# Altium schematic sheet USER_IO.SchDoc
size Tabloid; SheetNumber: 1; SheetTotal: 7
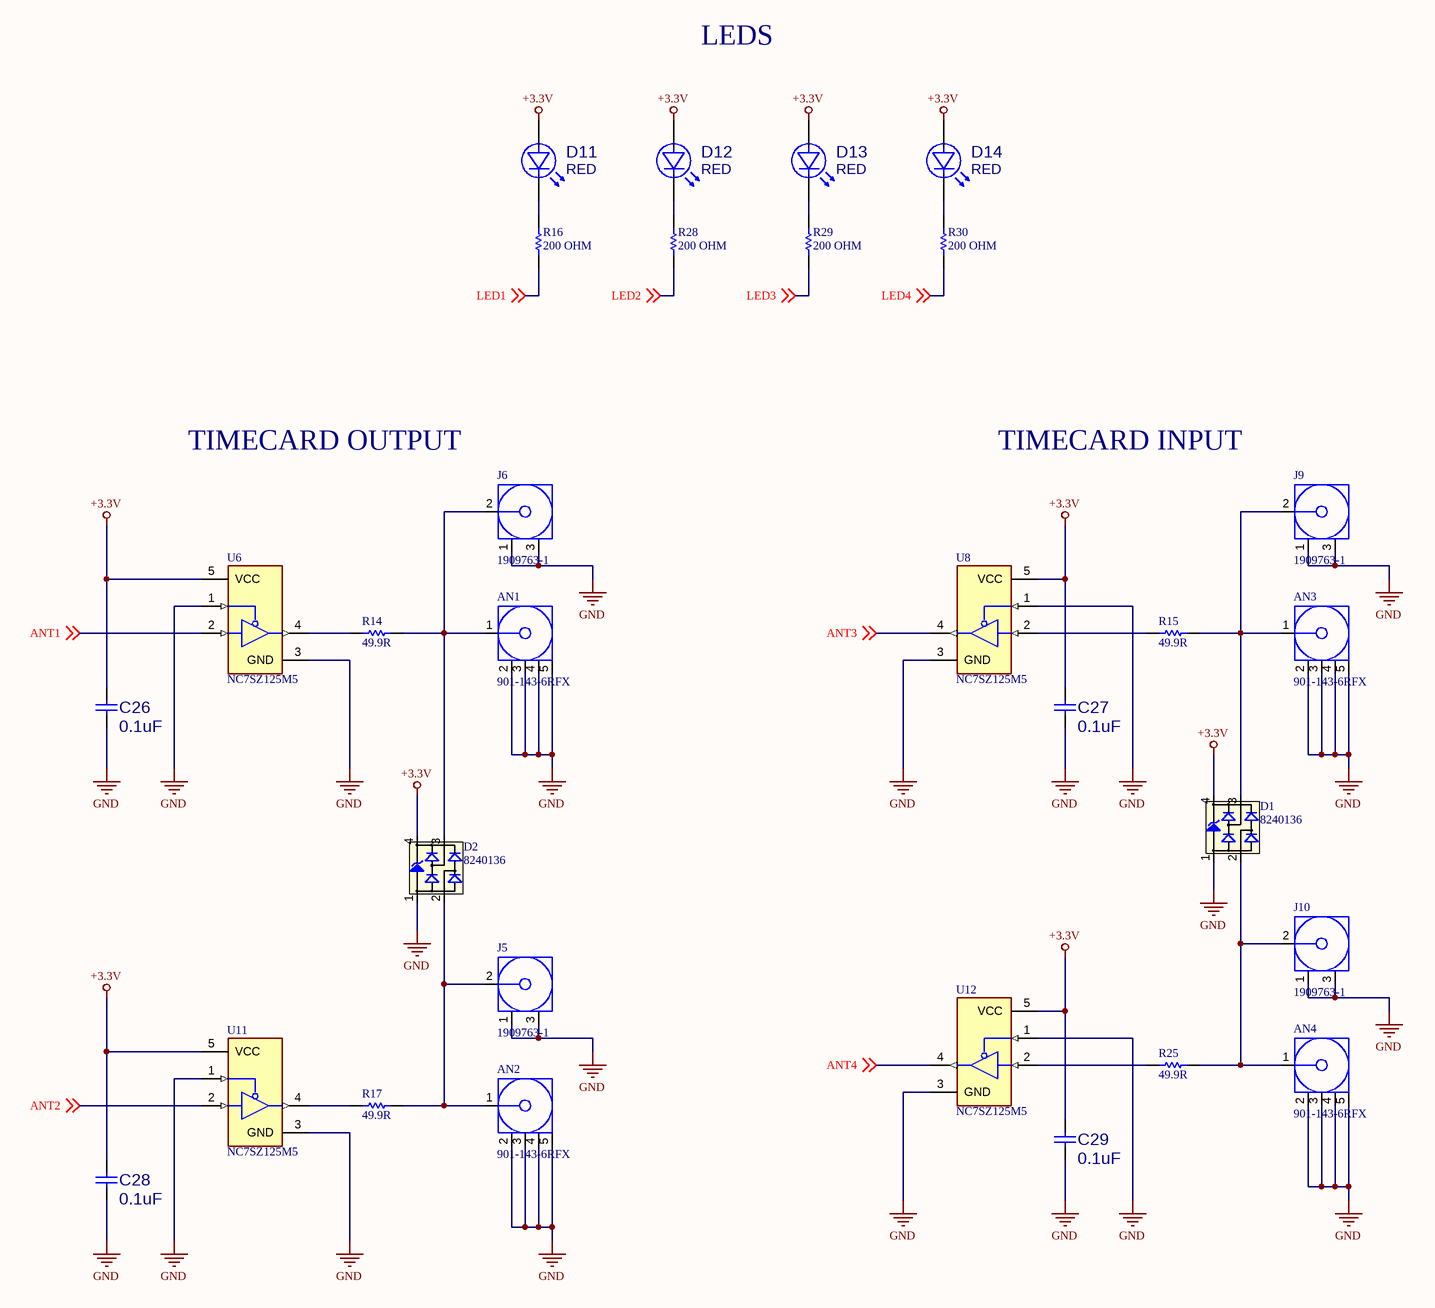
[diagram p0: USER_IO.SchDoc]

## Parts
AN1  901-143-6RFX  [AMPH-901-143-6RFX_V]
AN2  901-143-6RFX  [AMPH-901-143-6RFX_V]
AN3  901-143-6RFX  [AMPH-901-143-6RFX_V]
AN4  901-143-6RFX  [AMPH-901-143-6RFX_V]
C26  0.1uF  [CAPC1608X87X45ML20T05]
C27  0.1uF  [CAPC1608X87X45ML20T05]
C28  0.1uF  [CAPC1608X87X45ML20T05]
C29  0.1uF  [CAPC1608X87X45ML20T05]
D1  8240136  [SOT143-4L]
D2  8240136  [SOT143-4L]
D11  RED  [DIOM1608X06N]
D12  RED  [DIOM1608X06N]
D13  RED  [DIOM1608X06N]
D14  RED  [DIOM1608X06N]
J5  1909763-1  [TECO-1909763-1_V]
J6  1909763-1  [TECO-1909763-1_V]
J9  1909763-1  [TECO-1909763-1_V]
J10  1909763-1  [TECO-1909763-1_V]
R14  49.9R  [RESC1608X55X25NL10T15]
R15  49.9R  [RESC1608X55X25NL10T15]
R16  200 OHM  [RESC1608X55X30NL15T15]
R17  49.9R  [RESC1608X55X25NL10T15]
R25  49.9R  [RESC1608X55X25NL10T15]
R28  200 OHM  [RESC1608X55X30NL15T15]
R29  200 OHM  [RESC1608X55X30NL15T15]
R30  200 OHM  [RESC1608X55X30NL15T15]
U6  NC7SZ125M5  [FP-318BQ-MFG]
U8  NC7SZ125M5  [FP-318BQ-MFG]
U11  NC7SZ125M5  [FP-318BQ-MFG]
U12  NC7SZ125M5  [FP-318BQ-MFG]

## Nets
+3.3V: C26.1 C27.1 C28.1 C29.1 D1.4(VDD) D2.4(VDD) D11.2(A) D12.2(A) D13.2(A) D14.2(A) U6.5(VCC) U8.5(VCC) U11.5(VCC) U12.5(VCC)
GND: AN1.2 AN1.3 AN1.4 AN1.5 AN2.2 AN2.3 AN2.4 AN2.5 AN3.2 AN3.3 AN3.4 AN3.5 AN4.2 AN4.3 AN4.4 AN4.5 C26.2 C27.2 C28.2 C29.2 D1.1(GND) D2.1(GND) J5.1 J5.3 J6.1 J6.3 J9.1 J9.3 J10.1 J10.3 U6.1(~{OE}) U6.3(GND) U8.1(~{OE}) U8.3(GND) U11.1(~{OE}) U11.3(GND) U12.1(~{OE}) U12.3(GND)
ANT1: U6.2(A) ; off-sheet ANT1
ANT2: U11.2(A) ; off-sheet ANT2
ANT3: U8.4(Y) ; off-sheet ANT3
ANT4: U12.4(Y) ; off-sheet ANT4
LED1: R16.1 ; off-sheet LED1
LED2: R28.1 ; off-sheet LED2
LED3: R29.1 ; off-sheet LED3
LED4: R30.1 ; off-sheet LED4
NetAN1_1: AN1.1 D2.3(I/O2) J6.2 R14.2
NetAN2_1: AN2.1 D2.2(I/O1) J5.2 R17.2
NetAN3_1: AN3.1 D1.3(I/O2) J9.2 R15.2
NetAN4_1: AN4.1 D1.2(I/O1) J10.2 R25.2
NetD11_1: D11.1(K) R16.2
NetD12_1: D12.1(K) R28.2
NetD13_1: D13.1(K) R29.2
NetD14_1: D14.1(K) R30.2
NetR14_1: R14.1 U6.4(Y)
NetR15_1: R15.1 U8.2(A)
NetR17_1: R17.1 U11.4(Y)
NetR25_1: R25.1 U12.2(A)

## Notes on the sheet
- LEDS
- TIMECARD OUTPUT
- TIMECARD INPUT
- SHEET
- timingcard.com <http://timingcard.com>
- OF

## Library data of the parts
AN1-AN4 = CMP-2000-05705-1: Coaxial connector, 50 Ohm, -65 to 165 degC, 5-Pin THD, RoHS, Bulk; Manufacturer: Amphenol; Catalog Drawings: 901-143-6RFXMountingHole; 3D Model: 901-143-6RFX.igs; Body Material: Brass; Connector Type: Jack,FemaleSocket; Shield Termination: Solder; Other Names: 901-143-6-RFX9011436RFXARFX1232; Online Catalog: SMA,RFX; Frequency - Max: 18GHz; Body Finish: Gold; Dielectric Material: Polytetrafluoroethylene(PTFE); Center Contact Material: BerylliumCopper; Impedance: 50Ohm; Connector Style: SMA; Mounting Technology: ThroughHole; Mounting Type: ThroughHole,RightAngle; Cable Group: -; Series: -; Package Description: 5-Pin Through Hole Device, Body 7 x 7 mm, Pitch 2.54 mm; Package Reference: 901-143-6RFX; Voltage Rating: -; Standard Package: 1; Fastening Type: Threaded; Housing Color: Gold; Datasheet URL: http://www.amphenolrf.com/downloads/dl/file/id/2712/product/3102/901_143_6rfx_customer_drawing.pdf; Family: CoaxialConnectors(RF); Contact Termination: Solder; Manufacturer URL: http://www.amphenol.com/; Operating Temperature: -65°C~165°C; Category: Connectors,Interconnects; Packaging: Bulk; Features: -; Center Contact Plating: Gold; Datasheet Version: Rev. C, 06/2010; Ingress Protection: -
C26-C29 = CMP-2006-00003-1: C0603X104K5RACAUTO; Manufacturer: Kemet; Part Number: C0603X104K5RACAUTO
D1 D2 = CMP-1486-00002-1: TVS Diode WE-TVS-HS, VRWM=3.3V; Manufacturer: Wuerth Elektronik; Reverse Stand Off Voltage: 3.3V; PartNumber: 8240136; ComponentLink1Description: Manufacturer URL; PackageReference: SOT143-4L; ComponentLink1URL: http://www.we-online.com; ComponentLink2Description: Datasheet; ComponentLink2URL: http://katalog.we-online.de/kataloge/eisos/media/pdf/8240136.pdf
D11-D14 = SMTLED_RED_0603_SML: LED, RED, SML-LX0603, 635NM, 2V, 20MA, 0603; MFG PART NUM: SML-LX0603IW-TR; VALENTIUM PART NUM: <VALENTIUM>; MFG NAME: LUMEX; MAXTEMP: 85C; MINTEMP: -25C; MODIFY DATE: 9/4/2013; CATEGORY: LED; OTHER: SML-LX0603; P1: 635NM; P2: 2V; P3: 20MA; SIZE: 0603; SHEETPART: *; DESC: LED, RED, SML-LX0603, 635NM, 2V, 20MA, 0603; Supplier 1: Digi-Key; Supplier Part Number 1: 67-1548-1-ND; VALUE: RED
J5 J6 J9 J10 = CMP-2000-07505-1: Ultra Miniature Coaxial Connector Jack, 60 V, 50 Ohm, -40 to 90 degC, RoHS, Tape and Reel; Manufacturer: TE Connectivity; Gender: Female; PCB Mounting Orientation: Vertical; Body Material: LiquidCrystalPolymer; Case\/Package: SMD/SMT; Impedance: 50Ohm; Max Frequency: 6GHz; Body Plating: Gold; Dielectric Material: Polymer; Orientation: Straight; Mount: SurfaceMount; Length: 3mm; Packaging: TapeandReel; Connector Type: Jack; Lead Free: LeadFree; Package Quantity: 1; Termination: SMD/SMT; Contact Material: CopperAlloy; Fastening Type: Pull; RoHSCompliant: true; Max Operating Temperature: 90degC; Datasheet URL: http://www.te.com/commerce/DocumentDelivery/DDEController?Action=srchrtrv&DocNm=1909763&DocType=Customer+Drawing&DocLang=English; Contact Plating: Gold; Mounting Technology: SurfaceMount; Package Reference: TECO-1909763-1; Insulation Material: Thermoplastic; Min Operating Temperature: -40degC; Manufacturer URL: http://www.te.com/; ELV: Compliant; Datasheet Version: Rev. B2, 11/2015; Radiation Hardening: No; Package Description: 3-Pin Surface Mount Device, Body 2.6 x 2.6 mm; Housing Colour: Beige
R14 R15 R17 R25 = CMP-1659-00036-1: General Purpose Chip Resistor, 49.9 Ohm, +/- 1%, -55 to 155 degC, 0603 (1608 Metric), RoHS, Tape and Reel; Max Supply Voltage: 3.63 V; Case\Package: LQFP; Interface: SPI; Min Supply Voltage: 2.97 V; PackageReference: 0603; Packaging: Tray; ComponentLink2Description: Datasheet; ComponentLink1Description: Manufacturer URL; ComponentLink2URL: https://datasheet.ciiva.com/11808/0900766b80f96399-11808223.pdf; RoHSCompliant: true; Max Operating Temperature: 85 degC; ComponentLink1URL: http://www.yageo.com/; PackageDescription: 2-Pin Surface Mount Device, Body 1.6 x 0.8 mm; DatasheetVersion: Rev. 4, 04/2009; Min Operating Temperature: -40 degC; Package Quantity: 250; Pins: 48
R16 R28-R30 = CMP-2000-00316-1: ERJ-3EKF2000V; Manufacturer: Panasonic; Part Number: ERJ-3EKF2000V
U6 U8 U11 U12 = CMP-07111-000001-1: IC BUF NON-INVERT 5.5V SOT23-5; Manufacturer: ON Semiconductor; Number Of Circuits: 1; Max Junction Temp: +150°C; Standoff Height: 0.01mm; Logic Function Desc: Non-Inverting; Nominal Supply Current: 2uA; Min Supply Voltage: 1.65V; Propagation Delay: 2.6ns; Temperature Range High: +85°C; Number Of Outputs: 1; RoHS: TRUE; Automotive: No; Category: IC; Ambient Temperature Range High: +85°C; Manufacturer Part Number: NC7SZ125M5; Device Class L3: Buffers; Temperature Range Low: -40°C; Mouser Description: Buffers & Line Drivers Buffer w/ 3-STAT O; Ambient Temperature Range Low: -40°C; Lead Free: Yes; Ipc Land Pattern Name: SOT95P275X100-5; Footprint Url: https://www.onsemi.com/pub/Collateral/527AH.PDF; Device Class L2: Logic ICs; Max Supply Voltage: 5.5V; Quiescent Current: 2uA; Number Of Inputs: 1; Height: 1.1mm; Temperature: -40°C to +85°C; Device Class L1: Integrated Circuits (ICs); ComponentLink2URL: https://www.onsemi.com/pub/Collateral/NC7SZ125-D.PDF; Digikey Description: IC BUF NON-INVERT 5.5V SOT23-5; Package: 318BQ; Octopart: https://octopart.com/nc7sz125m5-on+semiconductor-84330746; ComponentLink2Description: Datasheet